# EAGLE design Dual Servo Module (EAGLE 6.3)
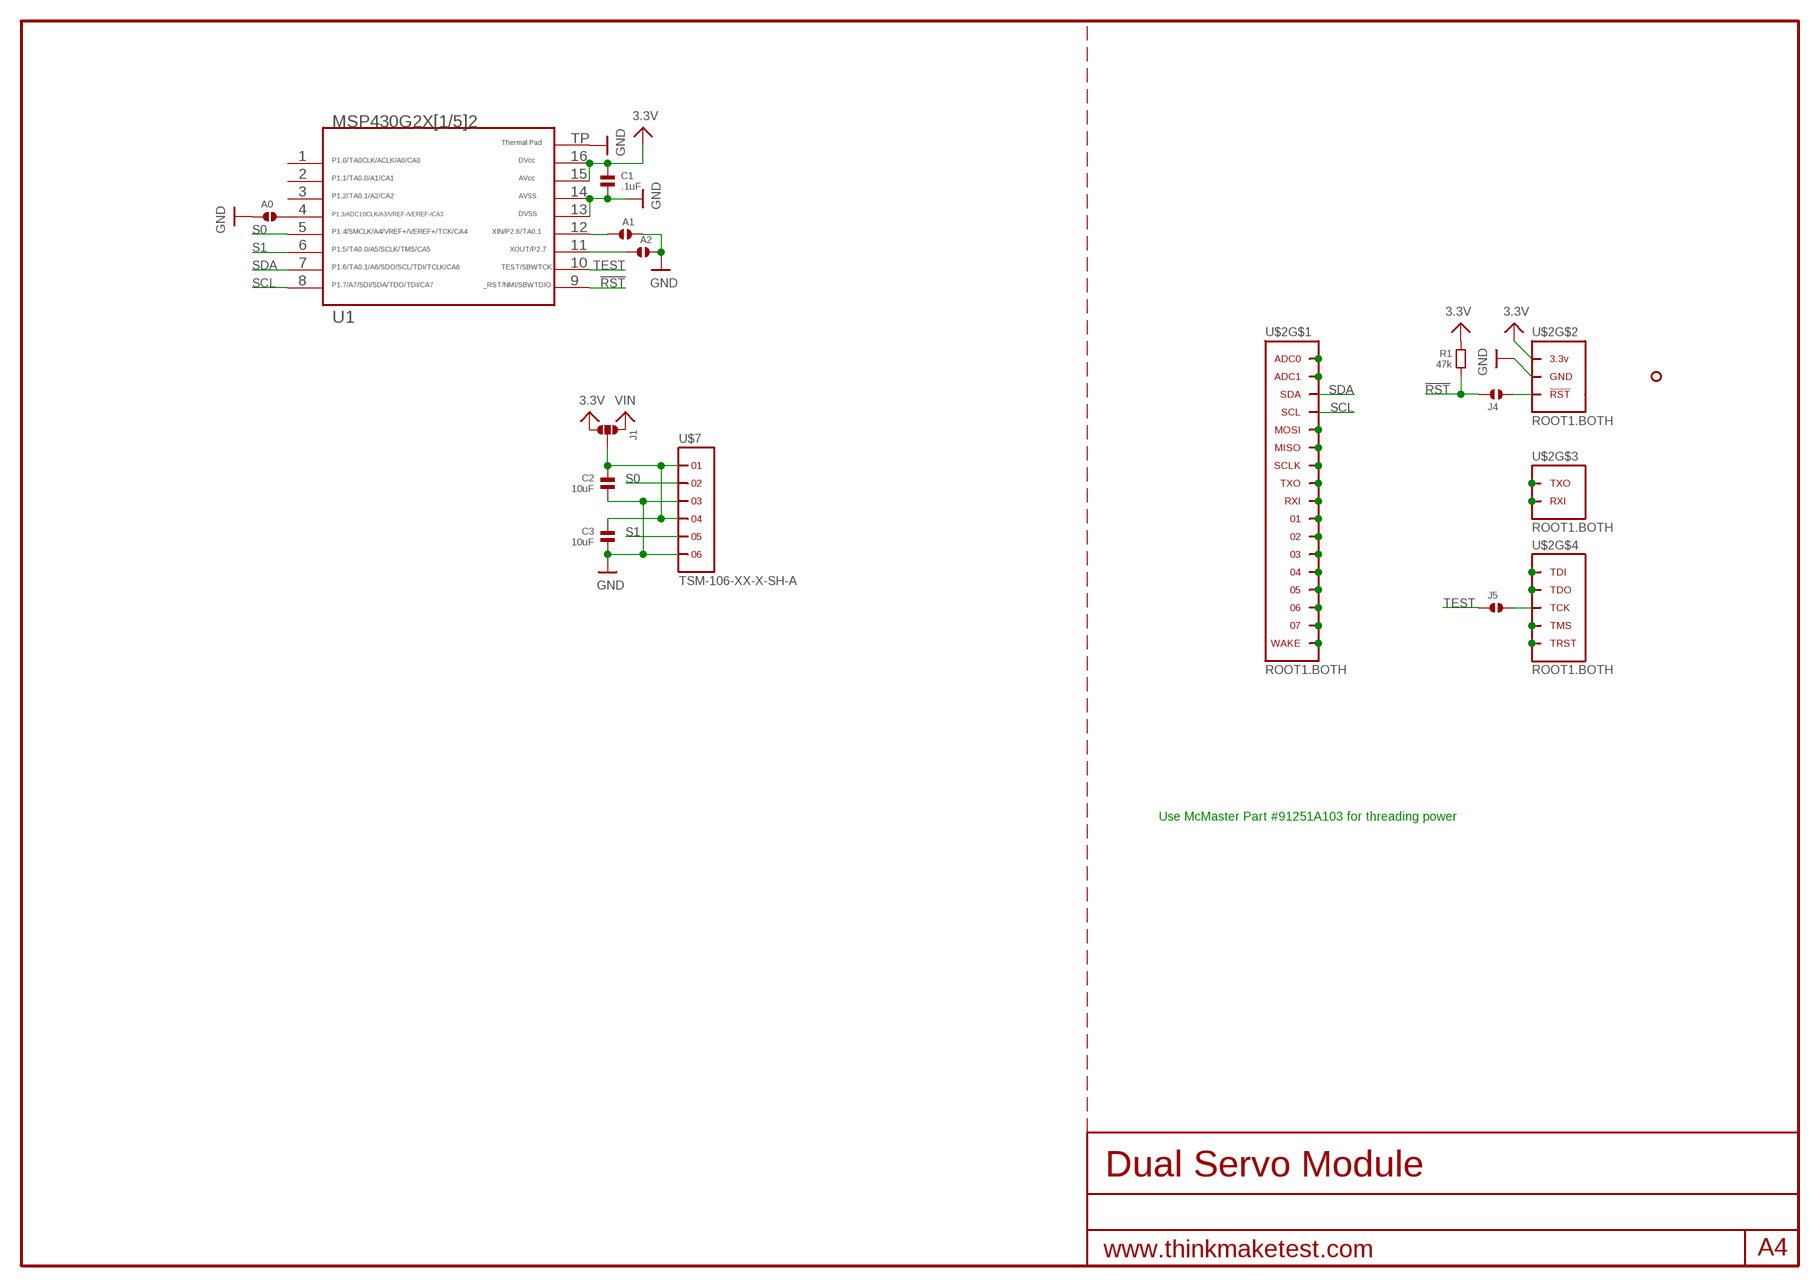
[diagram p0: schematic, sheet 1]

## Parts
A0  SOLDERJUMPER.2.MED  [2.MED]
A1  SOLDERJUMPER.2.MED  [2.MED]
A2  SOLDERJUMPER.2.MED  [2.MED]
C1  .1uF  CAPACITOR.0603  [0603]
C2  10uF  CAPACITOR.0805  [0805]
C3  10uF  CAPACITOR.0805  [0805]
J1  SOLDERJUMPER.3.LRG.12  [3.LRG.12]
J4  SOLDERJUMPER.2.MED  [2.MED]
J5  SOLDERJUMPER.2.MED  [2.MED]
R1  47k  RESISTOR.0603  [0603]
U1  MSP430G2452.QFN16  G2X[1/5]2---RSA16  [RSA16]
U$2  ROOT1.BOTH  [ROOT1.BOTH]
U$4  HOLE.#2  [#2]
U$7  TSM-106-XX-X-SH-A  [TSM-106-XX-X-SH-A]

## Nets
3.3V: C1.1 J1.3 R1.1 U1.15 U1.16 U$2.3.3V@1(3.3V) U$2.3.3V@2(3.3V) U$2.3.3V@3(3.3V) U$2.3.3V@4(3.3V) U$2.3.3V@5(3.3V) U$2.3.3V@6(3.3V) U$2.3.3V@7(3.3V) U$2.3.3V@8(3.3V) U$2.3.3V@9(3.3V) U$2.3.3V@10(3.3V) U$2.3.3V@11(3.3V) U$2.3.3V@12(3.3V) U$2.3.3V@13(3.3V) U$2.3.3V@14(3.3V) U$2.3.3V@15(3.3V) U$2.3.3V@16(3.3V) U$2.3.3V@17(3.3V) U$2.3.3V@18(3.3V) U$2.3.3V@19(3.3V) U$2.3.3V@20(3.3V) U$2.3.3V@21(3.3V) U$2.3.3V@22(3.3V) U$2.3.3V@23(3.3V) U$2.3.3V@24(3.3V) U$2.3.3V@VIA(3.3V)
!RST: J4.1 R1.2 U1.9
GND: A0.1 A1.1 A2.1 C1.2 C2.2 C3.2 U1.13 U1.14 U1.TP U$2.GND@1(GND) U$2.GND@2(GND) U$2.GND@3(GND) U$2.GND@4(GND) U$2.GND@5(GND) U$2.GND@6(GND) U$2.GND@7(GND) U$2.GND@8(GND) U$2.GND@9(GND) U$2.GND@10(GND) U$2.GND@11(GND) U$2.GND@12(GND) U$2.GND@13(GND) U$2.GND@14(GND) U$2.GND@15(GND) U$2.GND@16(GND) U$2.GND@17(GND) U$2.GND@18(GND) U$2.GND@19(GND) U$2.GND@20(GND) U$2.GND@21(GND) U$2.GND@22(GND) U$2.GND@23(GND) U$2.GND@24(GND) U$2.GND@25(GND) U$2.GND@26(GND) U$2.GND@VIA(GND) U$7.3 U$7.6
N$1: U$2.04 U$2.04@1 U$2.04@VIA
N$2: U$2.ADC1 U$2.ADC1@1(ADC1) U$2.ADC1@VIA(ADC1)
N$3: A2.2 U1.11
N$4: A1.2 U1.12
N$5: U$2.03 U$2.03@1 U$2.03@VIA
N$6: U$2.MISO U$2.MISO@1(MISO) U$2.MISO@VIA(MISO)
N$7: U$2.SCLK U$2.SCLK@1(SCLK) U$2.SCLK@VIA(SCLK)
N$8: U$2.TXO U$2.TXO@1(TXO) U$2.TXO@VIA(TXO)
N$9: U$2.RXI U$2.RXI@1(RXI) U$2.RXI@VIA(RXI)
N$10: U$2.01 U$2.01@1 U$2.01@VIA
N$11: U$2.02 U$2.02@1 U$2.02@VIA
N$12: U$2.MOSI U$2.MOSI@1(MOSI) U$2.MOSI@VIA(MOSI)
N$13: U$2.ADC0 U$2.ADC0@1(ADC0) U$2.ADC0@VIA(ADC0)
N$14: U$2.05 U$2.05@1 U$2.05@VIA
N$15: U$2.06 U$2.06@1 U$2.06@VIA
N$16: U$2.07 U$2.07@1 U$2.07@VIA
N$17: U$2.WAKE U$2.WAKE@1(WAKE) U$2.WAKE@VIA(WAKE)
N$18: U$2.TDI U$2.TDI@1(TDI) U$2.TDI@VIA(TDI)
N$19: U$2.TDO U$2.TDO@1(TDO) U$2.TDO@VIA(TDO)
N$20: J5.2 U$2.TCK U$2.TCK@1(TCK) U$2.TCK@VIA(TCK)
N$21: U$2.TMS U$2.TMS@1(TMS) U$2.TMS@VIA(TMS)
N$22: U$2.TRST U$2.TRST@1(TRST) U$2.TRST@VIA(TRST)
N$23: U$2.RXI.DBG(RXI) U$2.RXI.DBG@1(RXI) U$2.RXI.DBG@VIA(RXI)
N$24: U$2.TXO.DBG(TXO) U$2.TXO.DBG@1(TXO) U$2.TXO.DBG@VIA(TXO)
N$25: J4.2 U$2.RST(!RST) U$2.RST@1(!RST) U$2.RST@VIA(!RST)
N$26: A0.2 U1.4
N$27: C2.1 C3.1 J1.2 U$7.1 U$7.4
S0: U1.5 U$7.2
S1: U1.6 U$7.5
SCL: U1.8 U$2.SCL U$2.SCL@1(SCL) U$2.SCL@VIA(SCL)
SDA: U1.7 U$2.SDA U$2.SDA@1(SDA) U$2.SDA@VIA(SDA)
TEST: J5.1 U1.10
VIN: J1.1
Unconnected: U1.1 U1.2 U1.3

## Notes on the sheet
- Use McMaster Part #91251A103 for threading power

## Library data of the parts
A0 A1 A2 J4 J5 = .solderjumper:SOLDERJUMPER.2
C1-C3 = .standardparts:CAPACITOR
J1 = .solderjumper:SOLDERJUMPER.3
R1 = .standardparts:RESISTOR
U1 = TI_MSP430_v16:G2X[1/5]2---RSA16: MSP430G2X[1/5]2 MSP430G2x52, MSP430G2x12 QFN (RSA) 16 Pin Package http://focus.ti.com/docs/prod/folders/print/msp430g2452.html
U$2 = thinkmaketest:ROOT1
U$4 = .screw_holes:HOLE
U$7 = samtec:TSM-106-XX-X-SH-A

## Board
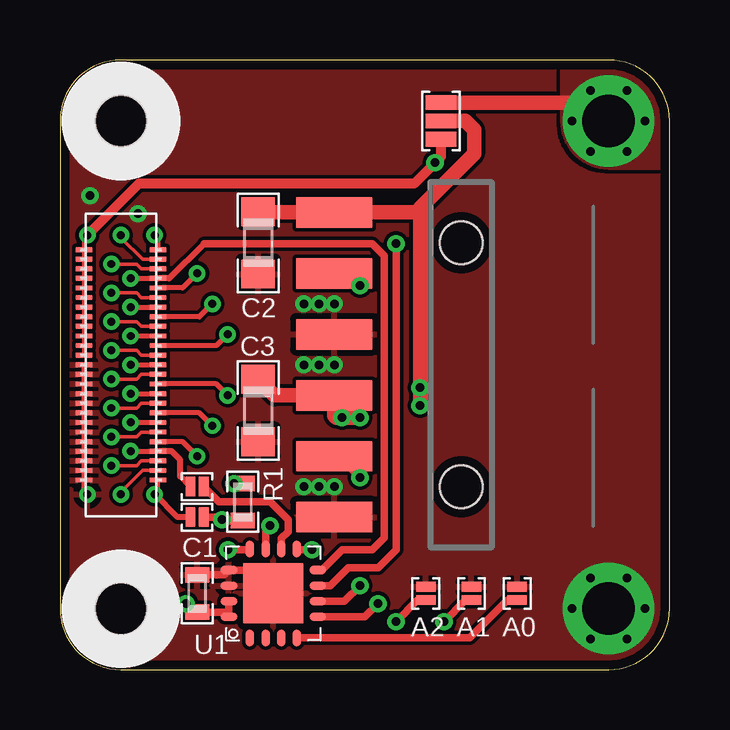
[diagram p1: board, top side]
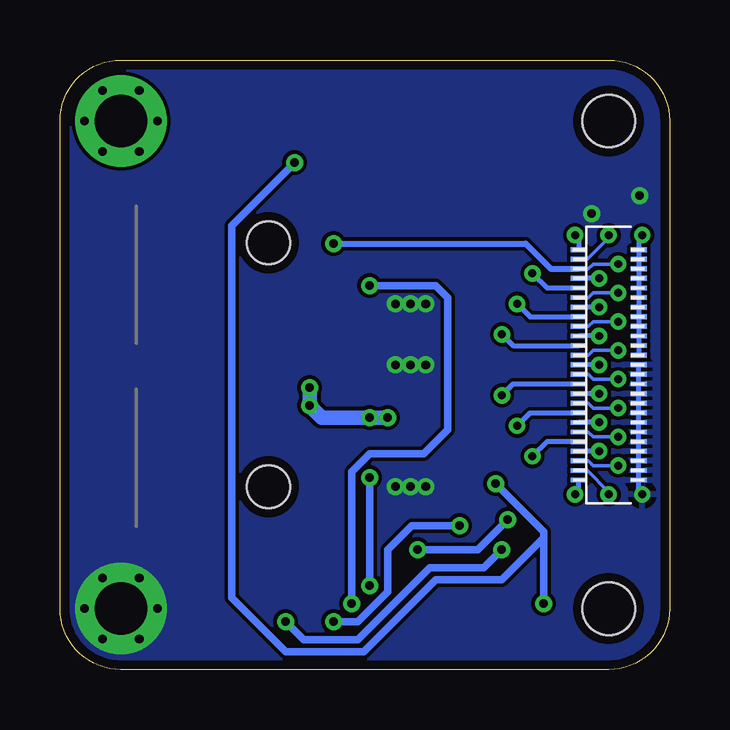
[diagram p2: board, bottom side, seen from below]

Size 25.4 x 25.4 mm. Coordinates in mm from the lower left corner, seen from the top.
Outline: 0,22.86 0,2.54 arc90 2.54,0 22.86,0 arc90 25.4,2.54 25.4,22.86 arc90 22.86,25.4 2.54,25.4 arc90 0,22.86
Copper layers (1*16): Top 0.0356mm / dielectric 1.5011mm / Bottom 0.0356mm
Design rules "default": minimum track width 6mil, minimum drill 13mil, track to track 6mil, track to pad 6mil, pad to pad 6mil, via to via 6mil, smd to smd 6mil, copper to edge 15mil, drill to drill 6mil, minimum pad ring 7mil, minimum via ring 7mil, stop-mask expansion 4mil, vias tented up to drill 16mil, thermal gap 10mil

### Footprints (pad centres in the part's own frame; a part is rotated, then mirrored left to right if it is on the bottom)
2.MED = smd 0.406 x 0.813: 1 -0.279,0; 2 0.279,0
0603 = smd 0.65 x 1: 1 -0.775,0; 2 0.775,0
0805 = smd 1.2 x 1.4: 1 -1.3,0; 2 1.3,0
3.LRG.12 = smd 0.61 x 1.27: 1 -0.762,0; 2 0,0; 3 0.762,0
RSA16 = smd 0.7 x 0.35: 1 -1.85,0.975; 2 -1.85,0.325; 3 -1.85,-0.325; 4 -1.85,-0.975; 9 1.85,-0.975; 10 1.85,-0.325; 11 1.85,0.325; 12 1.85,0.975 | smd 0.35 x 0.7: 5 -0.975,-1.85; 6 -0.325,-1.85; 7 0.325,-1.85; 8 0.975,-1.85; 13 0.975,1.85; 14 0.325,1.85; 15 -0.325,1.85; 16 -0.975,1.85 | smd 2.5 x 2.5: TP 0,0
ROOT1.BOTH = smd 0.66 x 0.2 bottom: 01 3.795,13.9; 02 3.795,13.5; 03 3.795,13.1; 3.3V@1 1.285,17.5; 3.3V@2 1.285,17.1; 3.3V@3 1.285,16.7; 3.3V@4 1.285,16.3; 3.3V@5 1.285,15.9; 3.3V@6 1.285,15.5; 3.3V@7 1.285,15.1; 3.3V@8 1.285,14.7; 3.3V@9 1.285,14.3; 3.3V@10 1.285,13.9; 3.3V@11 1.285,13.5; 3.3V@12 1.285,13.1; 04 3.795,12.7; 05 3.795,12.3; 06 3.795,11.9; 07 3.795,11.5; ADC0 3.795,17.5; ADC1 3.795,17.1; GND@1 1.285,7.9; GND@2 1.285,8.3; GND@3 1.285,8.7; GND@4 1.285,9.1; GND@5 1.285,9.5; GND@6 1.285,9.9; GND@7 1.285,10.3; GND@8 1.285,10.7; GND@9 1.285,11.1; GND@10 1.285,11.5; GND@11 1.285,11.9; GND@12 1.285,12.3; GND@13 1.285,12.7; MISO 3.795,15.5; MOSI 3.795,15.9; RST 3.795,7.9; RXI 3.795,14.3; RXI.DBG 3.795,10.3; SCL 3.795,16.3; SCLK 3.795,15.1; SDA 3.795,16.7; TCK 3.795,9.1; TDI 3.795,9.9; TDO 3.795,9.5; TMS 3.795,8.7; TRST 3.795,8.3; TXO 3.795,14.7; TXO.DBG 3.795,10.7; WAKE 3.795,11.1 | smd 0.7 x 0.2: 01@1 4.08,13.9; 02@1 4.08,13.5; 3.3V@13 1,17.5; 3.3V@14 1,17.1; 3.3V@15 1,16.7; 3.3V@16 1,16.3; 3.3V@17 1,15.9; 3.3V@18 1,15.5; 3.3V@19 1,15.1; 3.3V@20 1,14.7; 3.3V@21 1,14.3; 3.3V@22 1,13.9; 3.3V@23 1,13.5; 3.3V@24 1,13.1; 03@1 4.08,13.1; 04@1 4.08,12.7; 05@1 4.08,12.3; 06@1 4.08,11.9; 07@1 4.08,11.5; ADC0@1 4.08,17.5; ADC1@1 4.08,17.1; GND@14 1,7.9; GND@15 1,8.3; GND@16 1,8.7; GND@17 1,9.1; GND@18 1,9.5; GND@19 1,9.9; GND@20 1,10.3; GND@21 1,10.7; GND@22 1,11.1; GND@23 1,11.5; GND@24 1,11.9; GND@25 1,12.3; GND@26 1,12.7; MISO@1 4.08,15.5; MOSI@1 4.08,15.9; RST@1 4.08,7.9; RXI.DBG@1 4.08,10.3; RXI@1 4.08,14.3; SCL@1 4.08,16.3; SCLK@1 4.08,15.1; SDA@1 4.08,16.7; TCK@1 4.08,9.1; TDI@1 4.08,9.9; TDO@1 4.08,9.5; TMS@1 4.08,8.7; TRST@1 4.08,8.3; TXO.DBG@1 4.08,10.7; TXO@1 4.08,14.7; WAKE@1 4.08,11.1 | drill 0.33 pad 0.686: 01@VIA 2.94,13.9; 02@VIA 6.985,13.97; 3.3V@VIA 1.14,18.1; 03@VIA 2.14,13.3; 04@VIA 2.94,12.7; 05@VIA 2.14,12.1; 06@VIA 6.985,11.43; 07@VIA 2.94,11.5; ADC0@VIA 3.94,18.1; ADC1@VIA 2.54,18.1; GND@VIA 1.14,7.3; MISO@VIA 2.14,15.7; MOSI@VIA 5.715,16.51; RST@VIA 3.94,7.3; RXI.DBG@VIA 2.94,10.3; RXI@VIA 2.14,14.5; SCL@VIA 2.94,16.3; SCLK@VIA 2.94,15.1; SDA@VIA 2.14,16.9; TCK@VIA 2.94,9.1; TDI@VIA 2.14,9.7; TDO@VIA 5.715,8.89; TMS@VIA 2.14,8.5; TRST@VIA 2.54,7.3; TXO.DBG@VIA 6.35,10.16; TXO@VIA 6.35,15.24; WAKE@VIA 2.14,10.9
#2 = hole 2.184: 0,0
TSM-106-XX-X-SH-A = smd 1.27 x 3.175: 1 -6.35,0; 2 -3.81,0; 3 -1.27,0; 4 1.27,0; 5 3.81,0; 6 6.35,0 | hole 1.778: -5.08,5.283; 5.08,5.283

### Placement (x,y rotation side)
A0  19.05,3.17 270 top
A1  17.14,3.17 270 top
A2  15.24,3.17 270 top
C1  5.71,3.17 90 top
C2  8.26,17.78 270 top
C3  8.26,10.79 270 top
J1  15.88,22.86 270 top
J4  5.71,6.35 180 top
J5  5.71,7.62 180 top
R1  7.62,6.99 270 top
U1  8.89,3.17 90 top
U$2  0,0 0 top
U$3  HOLE.#2  [#2]  2.54,2.54 90 top
U$4  2.54,22.86 90 top
U$7  11.43,12.7 270 top

### Tracks (layer width: path | path; a pad name or v marks a point on that pad's centre or on a via)
3.3V  (via drill 0.36)
  Top 0.305: U1.15 U1.16 6.84,2.4 C1.1 5.6,2.4 v5.25,2.75 | v7.25,7.75 v7.26,7.76 R1.1
  Top 0.406: U$2.3.3V@VIA 3.29,20.25 14.75,20.25 v15.62,21.12 15.88,21.38 15.88,21.5 J1.3
  Bottom 0.305: v5.25,2.75 5.25,5.5 | 5.25,5.5 5.25,5.75 v7.25,7.75 | 5.25,5.5 7,3.75 9.75,3.75 12.75,0.75 16,0.75 18.25,3 18.25,18.5 v15.62,21.12
!RST  (via drill 0.36)
  Top 0.305: U1.9 9.89,5 v10.5,5 | J4.1 6.65,6.35 v6.75,6.25 6.79,6.21 R1.2
  Bottom 0.305: v10.5,5 8,5 v6.75,6.25
GND  (via drill 0.36, 2.18 pad 3.81)
  Top 0.305: U1.TP 7.92,4.15 U1.13 6.84,3.95 C1.2
  other vias: 22.86,2.54 21.34,2.54 24.38,2.54 22.1,3.81 23.62,3.81 23.62,1.27 22.1,1.27 11.43,7.62 10.79,7.62 10.16,7.62 11.43,15.24 10.79,15.24 10.16,15.24 11.43,12.7 10.79,12.7 10.16,12.7 1.25,19.75 3.25,19
  pour Bottom (rank 6): 0,0 25.4,0 25.4,25.4 0,25.4
  pour Top (rank 6): 0,0 25.4,0 25.4,25.4 0,25.4
N$3  (via drill 0.36)
  Top 0.305: U1.11 8.56,5.82 v8.75,6 | v14,2 14.9,2.9 A2.2
  Bottom 0.305: v8.75,6 10.75,6 11.75,5 11.75,3.25 13,2 v14,2
N$4  (via drill 0.36)
  Top 0.305: U1.12 7.89,5 v7,5 | v16,2 16.9,2.9 A1.2
  Bottom 0.305: v7,5 7.75,4.25 10,4.25 13,1.25 15.25,1.25 v16,2
N$20
  Top 0.254: J5.2 5,8.06 5,8.75 4.65,9.1 U$2.TCK@1
N$25
  Top 0.254: J4.2 4.89,6.35 U$2.RST@VIA
N$26
  Top 0.305: U1.4 17.07,1.32 18.65,2.9 A0.2
N$27  (via drill 0.36)
  Top 0.61: J1.2 16.89,22.86 17.25,22.5 17.25,21.5 15,19.25 | 15,19.25 14.8,19.05 U$7.1 8.29,19.05 C2.1 | v15,11 15,19.25 | v12.5,10.5 v11.75,10.5 11.5,10.5 11.43,10.57 U$7.4 8.92,11.43 C3.1
  Bottom 0.61: v11.75,10.5 v12.5,10.5 14.5,10.5 v15,11 v15,11.75
S0  (via drill 0.36)
  Top 0.305: U1.5 12.7,2.2 v13.25,2.75 | v12.5,16 11.99,16.51 U$7.2
  Bottom 0.305: v13.25,2.75 13.25,8.25 12.5,9 10.25,9 9.25,10 9.25,15.5 9.75,16 v12.5,16
S1  (via drill 0.36)
  Top 0.305: U1.6 11.85,2.85 v12.5,3.5 | v12.5,8 11.61,8.89 U$7.5
  Bottom 0.305: v12.5,3.5 v12.5,8
SCL
  Top 0.254: 6,17.75 4.55,16.3 U$2.SCL@1
  Top 0.305: U1.8 10.9,4.15 11.75,5 13,5 13.5,5.5 13.5,17.25 13,17.75 6,17.75
SDA  (via drill 0.36)
  Top 0.305: U1.7 11.25,3.5 12,4.25 13.25,4.25 14,5 v14,17.75
  Bottom 0.254: v14,17.75 6,17.75 4.95,16.7 U$2.SDA
TEST
  Top 0.305: U1.10 9.21,5.46 9.5,5.75 9.5,6.25 8.75,7 6.61,7 J5.1
VIN  (via drill 0.36, 2.18 pad 3.81)
  Top 0.61: v22.86,22.86 22.1,23.62 J1.1
  other vias: 24.38,22.86 21.34,22.86 22.1,24.13 23.62,24.13 23.62,21.59 22.1,21.59
  pour Top: 20.95,25.4 20.95,22.86 arc90 22.86,20.95 25.4,20.95 25.4,22.86 arc90 22.86,25.4

### Text on the board
tDocu: Vin | 3.3v | + | ~ | S0 | - | + | ~ | S1 | -
bDocu: + | ~ | S0 | - | + | ~ | v1 | S1 | - | Cruz Monrreal II | AnomalousMaker.com